# Altium project LM61495RPHR_Buck_converter_EVM.PrjPcb
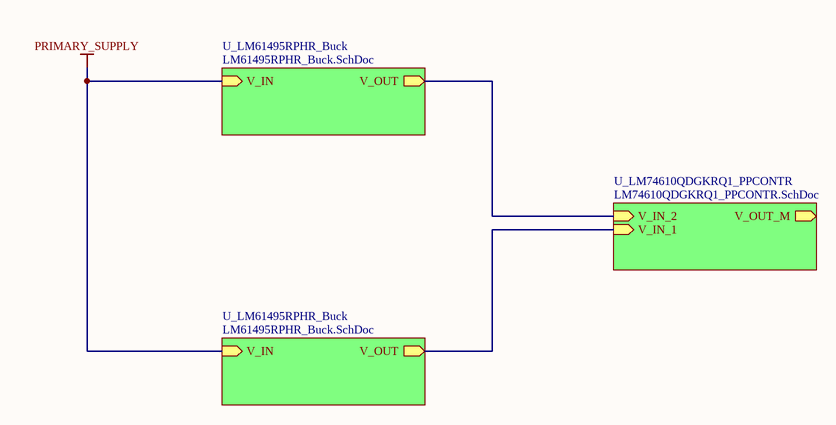
[diagram p0: DESIGN _FINAL.SchDoc]
3 sheets, 68 parts. Net scope: hierarchical (ports join the sheet entries above them; power ports are global).
Board files: LM61495RPHR_Buck.PcbDoc, LM74610QDGKRQ1_PPCONTR.PcbDoc
Sheets:
  DESIGN _FINAL.SchDoc
    U_LM61495RPHR_Buck = LM61495RPHR_Buck.SchDoc
    U_LM61495RPHR_Buck = LM61495RPHR_Buck.SchDoc
    U_LM74610QDGKRQ1_PPCONTR = LM74610QDGKRQ1_PPCONTR.SchDoc

## Sheet DESIGN _FINAL.SchDoc
size A; SheetNumber: 1; SheetTotal: 3

### Sub-sheets
U_LM61495RPHR_Buck = LM61495RPHR_Buck.SchDoc: V_IN (in), V_OUT (out)
U_LM61495RPHR_Buck = LM61495RPHR_Buck.SchDoc: V_IN (in), V_OUT (out)
U_LM74610QDGKRQ1_PPCONTR = LM74610QDGKRQ1_PPCONTR.SchDoc: V_OUT_M (out), V_IN_2 (in), V_IN_1 (in)

### Nets
PRIMARY_SUPPLY: sheet U_LM61495RPHR_Buck/V_IN, sheet U_LM61495RPHR_Buck/V_IN
Vout: sheet U_LM61495RPHR_Buck/V_OUT, sheet U_LM61495RPHR_Buck/V_OUT, sheet U_LM74610QDGKRQ1_PPCONTR/V_IN_2, sheet U_LM74610QDGKRQ1_PPCONTR/V_IN_1

## Sheet LM61495RPHR_Buck.SchDoc
size A3; SheetNumber: 2; SheetTotal: 3
Used 2 times, as channels U_LM61495RPHR_Buck, U_LM61495RPHR_Buck. Parts and nets are listed once, with the designators drawn on the sheet.
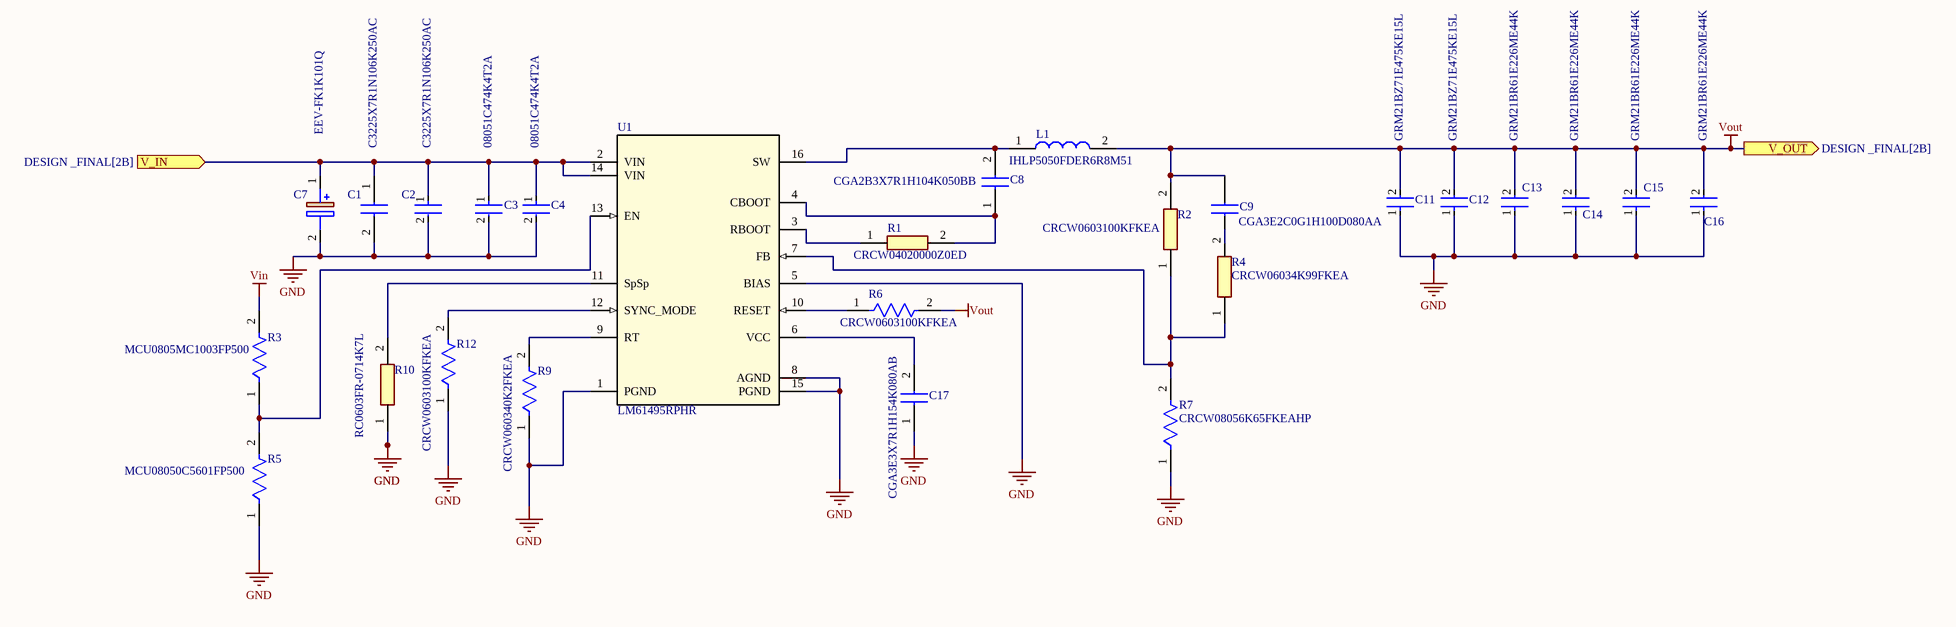
[diagram p1: LM61495RPHR_Buck.SchDoc]

### Parts
C1  C3225X7R1N106K250AC  [CAPC3225X230N]
C2  C3225X7R1N106K250AC  [FP-C3225-250-0_4-IPC_A]
C3  08051C474K4T2A  [FP-0805-L_2_01_0_2-W_1_25-MFG]
C4  08051C474K4T2A  [FP-0805-L_2_01_0_2-W_1_25-MFG]
C7  EEV-FK1K101Q  [EEEFK0J332AQ]
C8  CGA2B3X7R1H104K050BB  [CAPC1005X55N]
C9  CGA3E2C0G1H100D080AA  [CAPC1608X90N]
C11  GRM21BZ71E475KE15L  [FP-GRM21B-0_2-e0_2_0_7-MFG]
C12  GRM21BZ71E475KE15L  [FP-GRM21B-0_2-e0_2_0_7-MFG]
C13  GRM21BR61E226ME44K  [FP-GRM21B-0_2-e0_2_0_7-MFG]
C14  GRM21BR61E226ME44K  [FP-GRM21B-0_2-e0_2_0_7-MFG]
C15  GRM21BR61E226ME44K  [FP-GRM21B-0_2-e0_2_0_7-MFG]
C16  GRM21BR61E226ME44K  [FP-GRM21B-0_2-e0_2_0_7-MFG]
C17  CGA3E3X7R1H154K080AB  [GCM188]
L1  IHLP5050FDER6R8M51  [INDPM135129X640N]
R1  CRCW04020000Z0ED  [RESC1005X40N]
R2  CRCW0603100KFKEA  [RESC1608X50N]
R3  MCU0805MC1003FP500  [FP-MCU0805-IPC_B]
R4  CRCW06034K99FKEA  [RESC1608X50N]
R5  MCU08050C5601FP500  [FP-MCU0805-IPC_B]
R6  CRCW0603100KFKEA  [FP-CRCW0603C-e3-MFG]
R7  CRCW08056K65FKEAHP  [FP-CRCW0805-HPe3-IPC_C]
R9  CRCW060340K2FKEA  [FP-CRCW0603-e3-IPC_B]
R10  RC0603FR-0714K7L  [RESC1608X55N]
R12  CRCW0603100KFKEA  [FP-CRCW0603C-e3-MFG]
U1  LM61495RPHR  [RPH0016A]

### Ports
V_IN (in, see DESIGN _FINAL[2B]), V_OUT (out, see DESIGN _FINAL[2B])

### Nets
GND: C1.2 C2.2 C3.2 C4.2 C7.2(-) C11.1 C12.1 C13.1 C14.1 C15.1 C16.1 C17.1 R5.1 R7.1 R9.1 R10.1 R12.1 U1.1(PGND) U1.5(BIAS) U1.8(AGND) U1.15(PGND)
Vin: R3.2
Vout: C9.2 C11.2 C12.2 C13.2 C14.2 C15.2 C16.2 L1.2 R2.2 R6.2 ; port V_OUT
V_IN: C1.1 C2.1 C3.1 C4.1 C7.1(+) U1.2(VIN) U1.14(VIN) ; port V_IN
NetC8_1: C8.1 R1.2 U1.4(CBOOT)
NetC8_2: C8.2 L1.1 U1.16(SW)
NetC9_1: C9.1 R4.2
NetC17_2: C17.2 U1.6(VCC)
NetR1_1: R1.1 U1.3(RBOOT)
NetR2_1: R2.1 R4.1 R7.2 U1.7(FB)
NetR3_1: R3.1 R5.2 U1.13(EN)
NetR6_1: R6.1 U1.10(RESET)
NetR9_2: R9.2 U1.9(RT)
NetR10_2: R10.2 U1.11(SpSp)
NetR12_2: R12.2 U1.12(SYNC_MODE)

### Channels
U_LM61495RPHR_Buck: designators end in _U_LM61495RPHR_Buck#1; ports V_IN=PRIMARY_SUPPLY V_OUT=Vout
U_LM61495RPHR_Buck: designators end in _U_LM61495RPHR_Buck#2; ports V_IN=PRIMARY_SUPPLY V_OUT=Vout

### Library data of the parts
C1 = C3225X7R1N106K250AC: Capacitor; Manufacturer_Name: TDK; Datasheet Link: https://product.tdk.com/info/en/catalog/datasheets/mlcc_commercial_midvoltage_en.pdf; Height: 2.3mm; Manufacturer_Part_Number: C3225X7R1N106K250AC; Mouser Part Number: 810-C3225X7R1N106K25; Mouser Price/Stock: https://www.mouser.co.uk/ProductDetail/TDK/C3225X7R1N106K250AC?qs=P1JMDcb91o5%2Fi%252BA2Vs0UoQ%3D%3D; Arrow Part Number: C3225X7R1N106K250AC; Arrow Price/Stock: https://www.arrow.com/en/products/c3225x7r1n106k250ac/tdk?region=nac
C2 = CMP-08246-003742-1: Multilayer Ceramic Capacitors 10uF ±10% 75V X7R SMD 1210; RoHS Compliant: Yes
C3 C4 = CMP-2007-04773-2: Automotive Ceramic Capacitor, 0805, 470nF, 10%, X7R, 15%, 100V; Packaging: Tape and Reel; Depth: 1.25mm; Voltage Rating (DC): 100V; Length: 2.01mm; Tolerance: 10%; Construction: Flat; Lead Free: Lead Free; Case Code (Metric): 2012; Capacitance: 470nF; Case Code (Imperial): 0805; Max Operating Temperature: 125°C; Dielectric: X7R; Mount: Surface Mount; Min Operating Temperature: -55°C; Voltage Rating: 100V; Radiation Hardening: No; Termination: SMD/SMT; Case/Package: 0805
C7 = EEV-FK1K101Q: Capacitor Polarised; Manufacturer_Name: Panasonic; Datasheet Link: http://industrial.panasonic.com/cdbs/www-data/pdf/RDE0000/ABA0000C1181.pdf; Height: 15mm; Manufacturer_Part_Number: EEV-FK1K101Q; Mouser Part Number: 667-EEV-FK1K101Q; Mouser Price/Stock: https://www.mouser.co.uk/ProductDetail/Panasonic/EEV-FK1K101Q?qs=E4hy2mN5dtmkz2M2wNGN2w%3D%3D; Arrow Part Number: EEV-FK1K101Q; Arrow Price/Stock: https://www.arrow.com/en/products/eev-fk1k101q/panasonic?utm_currency=USD&region=nac
C8 = CGA2B3X7R1H104K050BB: Capacitor; Manufacturer_Name: TDK; Datasheet Link: http://docs-europe.electrocomponents.com/webdocs/14e9/0900766b814e9125.pdf; Height: 0.55mm; Manufacturer_Part_Number: CGA2B3X7R1H104K050BB; Mouser Part Number: 810-CGA2B3X7R1H104K; Mouser Price/Stock: https://www.mouser.co.uk/ProductDetail/TDK/CGA2B3X7R1H104K050BB?qs=NRhsANhppD%252ByZlMHlsweIw%3D%3D; Arrow Part Number: CGA2B3X7R1H104K050BB; Arrow Price/Stock: https://www.arrow.com/en/products/cga2b3x7r1h104k050bb/tdk?region=nac
C9 = CGA3E2C0G1H100D080AA_1: TDK 0603 CGA 10pF Ceramic Multilayer Capacitor, 50 V dc, +125C, C0G Dielectric, +/-0.5pF; Geometry.Height: 0.9mm; Manufacturer_Name: TDK; Manufacturer_Part_Number: CGA3E2C0G1H100D080AA; Mouser Part Number: 810-CGA3E2C0G1H100D; Mouser Price/Stock: https://www.mouser.co.uk/ProductDetail/TDK/CGA3E2C0G1H100D080AA?qs=FxQuwy19cyAWoBWxXEx%2FUg%3D%3D; Arrow Part Number: *; Arrow Price/Stock: *; Datasheet Link: http://docs-europe.electrocomponents.com/webdocs/14e9/0900766b814e9125.pdf
C11 C12 = CMP-06035-039079-1: Chip Multilayer Ceramic Capacitors for General Purpose, 0805, 4.7uF, X7R, 15%, 10%, 25V
C13-C16 = CMP-06035-036790-1: Chip Multilayer Ceramic Capacitors for General Purpose, 0805, 22uF, X5R, 15%, 20%, 25V; Mount: Surface Mount; Voltage Rating: 25V; Capacitance: 22uF; Weight: 0.000335oz; Max Operating Temperature: 85°C; Dielectric: X5R; Length: 0.079inch; Voltage Rating (DC): 25V; Resistor Type: Ceramic; Package Quantity: 10000; Case Code (Imperial): 0805; Tolerance: 20%; Height: 1.25mm; Case/Package: 0805; Case Code (Metric): 2012; Min Operating Temperature: -55°C; Packaging: Tape and Reel; Thickness: 0.057inch; Width: 1.25mm; Termination: SMD/SMT
C17 = GCM188R71C105MA64D: CAP CER 0.15UF 50V X7R 0603; Manufacturer_Name: Murata Electronics; Datasheet Link: https://search.murata.co.jp/Ceramy/image/img/A01X/G101/ENG/GCM188R71C105MA64-04A.pdf; Height: 0.9mm; Manufacturer_Part_Number: GCM188R71C105MA64D; Mouser Part Number: 81-GCM188R71C105MA4D; Mouser Price/Stock: https://www.mouser.com/Search/Refine.aspx?Keyword=81-GCM188R71C105MA4D; Arrow Part Number: GCM188R71C105MA64D; Arrow Price/Stock: https://www.arrow.com/en/products/gcm188r71c105ma64d/murata-manufacturing
L1 = IHLP5050FDER6R8M51: Inductor; Manufacturer_Name: Vishay; Datasheet Link: https://www.mouser.com/datasheet/2/427/ihlp5050fd51-1763968.pdf; Height: 6.4mm; Manufacturer_Part_Number: IHLP5050FDER6R8M51; Mouser Part Number: 70-IHLP5050FDR6R8M51; Mouser Price/Stock: https://www.mouser.co.uk/ProductDetail/Vishay-Dale/IHLP5050FDER6R8M51?qs=tDDpbAIEejpo82ME3ZJqPQ%3D%3D
R1 = CRCW04020000Z0EDHP: Resistor; Manufacturer_Name: Vishay; Datasheet Link: http://www.vishay.com/docs/20035/dcrcwe3.pdf; Height: 0.4mm; Manufacturer_Part_Number: CRCW04020000Z0EDHP; Mouser Part Number: 71-CRCW04020000Z0EDH; Mouser Price/Stock: https://www.mouser.co.uk/ProductDetail/Vishay-Dale/CRCW04020000Z0EDHP?qs=pTGEtN%252BMLlAWtXUIKBil9w%3D%3D; Arrow Part Number: CRCW04020000Z0EDHP; Arrow Price/Stock: https://www.arrow.com/en/products/crcw04020000z0edhp/vishay?utm_currency=USD&region=nac
R2 = CRCW0603100KFKEA: Resistor; Manufacturer_Name: Vishay; Datasheet Link: http://www.vishay.com/docs/20035/dcrcwe3.pdf; Height: 0.5mm; Manufacturer_Part_Number: CRCW0603100KFKEA; Mouser Part Number: 71-CRCW0603-100K-E3; Mouser Price/Stock: https://www.mouser.co.uk/ProductDetail/Vishay-Dale/CRCW0603100KFKEA?qs=6dqgS%252BKntICWHMMdIzt5%2FQ%3D%3D; Arrow Part Number: CRCW0603100KFKEA; Arrow Price/Stock: https://www.arrow.com/en/products/crcw0603100kfkea/vishay?utm_currency=USD&region=nac
R3 = CMP-02407-000323-1: RES 1.05K OHM 0.5% 1/5W 0805; Tolerance: 1%; Resistance: 100kR; Max Operating Temperature: 125°C; Packaging: Tape and Reel; Min Operating Temperature: -55°C; Depth: 1.25mm; Case/Package: 0805; Military Standard: Not; Composition: Thin Film; Length: 2mm
R4 = CRCW06034K99FKEA: Resistor; Manufacturer_Name: Vishay; Datasheet Link: http://www.vishay.com/docs/20035/dcrcwe3.pdf; Height: 0.5mm; Manufacturer_Part_Number: CRCW06034K99FKEA; Mouser Part Number: 71-CRCW0603-4.99K-E3; Mouser Price/Stock: https://www.mouser.co.uk/ProductDetail/Vishay-Dale/CRCW06034K99FKEA?qs=hsLMhf4r0Mayldu5NgAo%2Fg%3D%3D; Arrow Part Number: CRCW06034K99FKEA; Arrow Price/Stock: https://www.arrow.com/en/products/crcw06034k99fkea/vishay?region=nac
R5 = CMP-02407-001419-1: RES 1.05K OHM 0.5% 1/5W 0805; Resistance: 5.6kR; Tolerance: 1%; Temperature Coefficient: 50ppm/°C; Case/Package: 0805; Depth: 1.25mm; Radiation Hardening: No; Military Standard: Not; Packaging: Tape and Reel; Max Operating Temperature: 125°C; Composition: Thin Film; Lead Free: Lead Free; Contact Plating: Tin; Length: 2mm; Min Operating Temperature: -55°C; Width: 1.25mm
R6 R12 = CMP-02407-011574-1: RES SMD 100K OHM 1% 1/10W 0603; Temperature Coefficient: 100ppm/°C; Resistance: 100kR; Power Rating: 100mW; Value: 100kR; Contact Plating: Tin; Length: 1.55mm; Mount: Surface Mount; Min Operating Temperature: -55°C; RoHS Compliant: Yes; Max Operating Temperature: 155°C; Tolerance: 1%; Resistor Type: Thick Film; Termination: Wraparound; Case/Package: Molded; Lead Free: Lead Free
R7 = CMP-02407-011694-1: RES Thick Film, 6.65kΩ, 1%, 0.5W, 100ppm/°C, 0805; Max Power Dissipation: 333mW; Resistance: 6.65kR; Temperature Coefficient: 100ppm/°C; Tolerance: 1%; Package Quantity: 5000; Lead Free: Lead Free; Case/Package: 0805; Length: 0.079inch; Series: CRCW-HP; Number of Terminations: 2; Features: Automotive AEC-Q200; Width: 0.049inch; Resistor Type: Thick Film; RoHS Compliant: Yes; Height: 0.024inch; Packaging: Tape and Reel
R9 = CMP-2000-03336-2: RES Thick Film, 40.2kΩ, 1%, 0.1W, 100ppm/°C, 0603; Voltage Rating (DC): 75V; Power Rating: 100mW; Resistance: 40.2kR; Value: 40.2kR; Packaging: Tape and Reel; Radiation Hardening: No; Lead Free: Lead Free; Contact Plating: Tin; Weight: 7.1E-05oz; Voltage Rating: 75V; Temperature Coefficient: 100ppm/°C; Case Code (Imperial): 0603; Max Operating Temperature: 155°C; Width: 0.85mm; Package Quantity: 5000; Termination: SMD/SMT; Case/Package: 0603; Case Code (Metric): 1608; Depth: 0.85mm; Tolerance: 1%; Composition: Thick Film; Length: 1.55mm; Military Standard: Not; Height: 0.45mm; Min Operating Temperature: -55°C
R10 = RC0603FR-0714K7L: Resistor; Manufacturer_Name: KEMET; Datasheet Link: http://www.yageo.com/documents/recent/PYu-RC0603_51_RoHS_L_v5.pdf; Height: 0.55mm; Manufacturer_Part_Number: RC0603FR-0714K7L; Mouser Part Number: 603-RC0603FR-0714K7L; Mouser Price/Stock: https://www.mouser.co.uk/ProductDetail/YAGEO/RC0603FR-0714K7L?qs=VU8sRB4EgwDFr61Mr4NajA%3D%3D
U1 = LM61495RPHR: 10-A buck converter optimized for power density and low EMI 16-VQFN-HR -40 to 150; Manufacturer_Name: Texas Instruments; TYPE: TYPE; RefDes: RefDes; Copyright: Copyright (C) 2025 Ultra Librarian. All rights reserved.; Manufacturer_Part_Number: LM61495RPHR; Datasheet: https://www.ti.com/lit/gpn/lm61495

## Sheet LM74610QDGKRQ1_PPCONTR.SchDoc
size A3; SheetNumber: 3; SheetTotal: 3
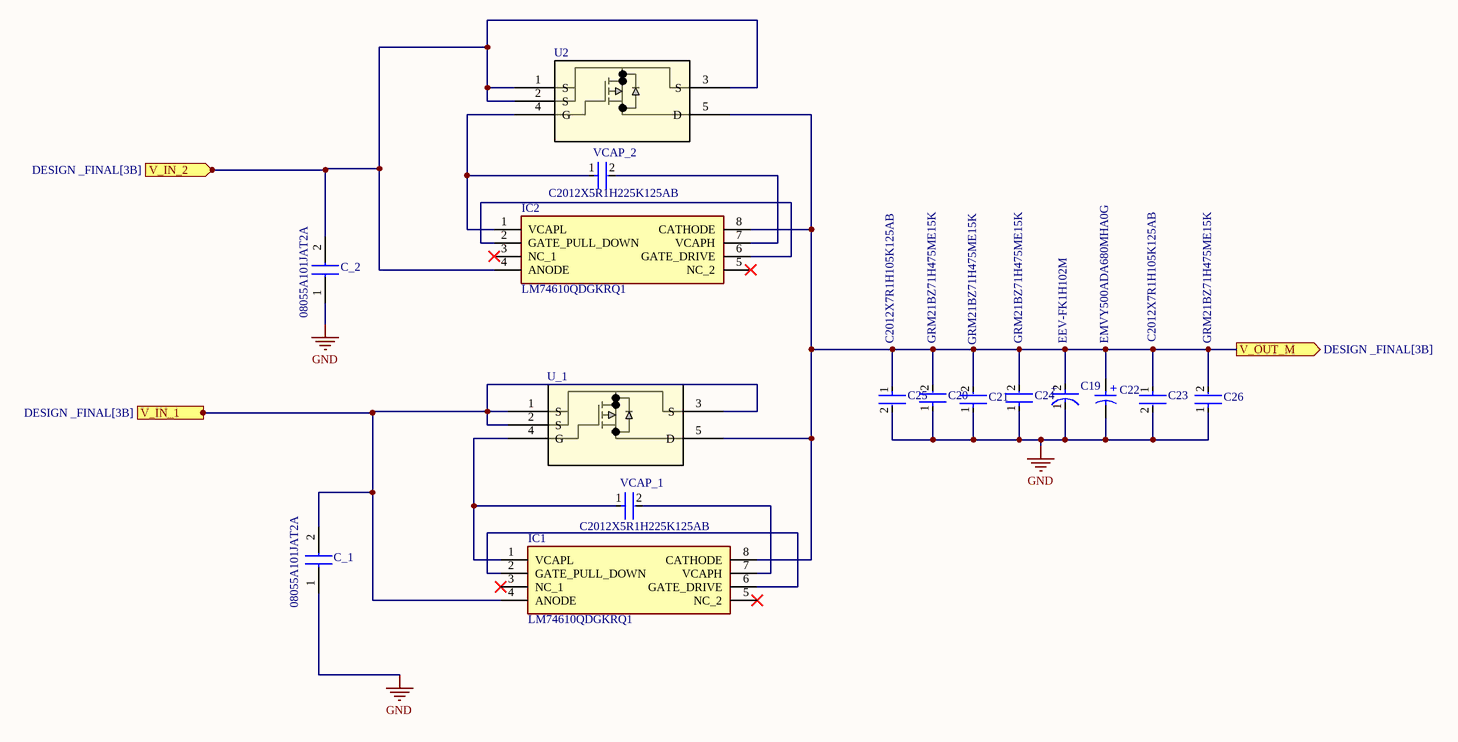
[diagram p2: LM74610QDGKRQ1_PPCONTR.SchDoc]

### Parts
C19  EEV-FK1H102M  [FP-FK-J16-MFG]
C20  GRM21BZ71H475ME15K  [FP-GRM21B-0_2-e0_2_0_7-MFG]
C21  GRM21BZ71H475ME15K  [FP-GRM21B-0_2-e0_2_0_7-MFG]
C22  EMVY500ADA680MHA0G  [WCAP-ASLI_D8H10.5]
C23  C2012X7R1H105K125AB  [FP-C2012-125-0_2-MFG]
C24  GRM21BZ71H475ME15K  [FP-GRM21B-0_2-e0_2_0_7-MFG]
C25  C2012X7R1H105K125AB  [FP-C2012-125-0_2-MFG]
C26  GRM21BZ71H475ME15K  [FP-GRM21B-0_2-e0_2_0_7-MFG]
C_1  08055A101JAT2A  [GRM21BR60J226ME39L]
C_2  08055A101JAT2A  [GRM21BR60J226ME39L]
IC1  LM74610QDGKRQ1  [SOP65P490X110-8N]
IC2  LM74610QDGKRQ1  [SOP65P490X110-8N]
U2  SQJ422EP-T1_GE3  [SO-8L_VIS]  (value not drawn)
U_1  SQJ422EP-T1_GE3  [SO-8L_VIS]  (value not drawn)
VCAP_1  C2012X5R1H225K125AB  [FP-C2012-125-0_2-IPC_C]
VCAP_2  C2012X5R1H225K125AB  [FP-C2012-125-0_2-IPC_C]

### Ports
V_IN_1 (in, see DESIGN _FINAL[3B]), V_IN_2 (in, see DESIGN _FINAL[3B]), V_OUT_M (out, see DESIGN _FINAL[3B])

### Nets
GND: C19.1(C) C20.1 C21.1 C22.2(N) C23.2 C24.1 C25.2 C26.1 C_1.1 C_2.1
Vout: C_1.2 C_2.2 IC1.4(ANODE) IC2.4(ANODE) U2.1(S) U2.2(S) U2.3(S) U_1.1(S) U_1.2(S) U_1.3(S) ; port V_IN_2, port V_IN_1
NetC19_2: C19.2(A) C20.2 C21.2 C22.1(P) C23.1 C24.2 C25.1 C26.2 IC1.8(CATHODE) IC2.8(CATHODE) U2.5(D) U_1.5(D) ; port V_OUT_M
NetIC1_1: IC1.1(VCAPL) U_1.4(G) VCAP_1.1
NetIC1_2: IC1.2(GATE_PULL_DOWN) IC1.6(GATE_DRIVE)
NetIC1_7: IC1.7(VCAPH) VCAP_1.2
NetIC2_1: IC2.1(VCAPL) U2.4(G) VCAP_2.1
NetIC2_2: IC2.2(GATE_PULL_DOWN) IC2.6(GATE_DRIVE)
NetIC2_7: IC2.7(VCAPH) VCAP_2.2

Not connected (* = marked no-connect by the designer): IC1 3(NC_1)* 5(NC_2)*; IC2 3(NC_1)* 5(NC_2)*

### Notes on the sheet
- (in symbol CMP-03913-53914624-1) +
- (in symbol CMP-05427-000011-1) +

### Library data of the parts
C19 = CMP-05427-000011-1: CAP ALUM 1000UF 20% 50V SMD; Manufacturer: Panasonic Electronic Components; Esr: 0.073Ω; Life: 2000Hours; Leakage Current: 500uA; Ripple Current: 1610mA; Dissipation Factor: 10%; Automotive Grade: Grade 2; Material: Aluminum; Capacitance: 1000uF; Tolerance: 20%; Device Class L1: Passive Components; Temperature: -55°C to +105°C; Device Class L2: Capacitors; Mouser Description: Cap Aluminum Lytic 1000uF 50V 20% (16 X 16.5mm) SMD 0.073 Ohm 1610mA 2000h 105C Automotive T/R; Category: Cap; Digikey Description: CAP ALUM 1000UF 20% 50V SMD; Value: 1000uF; Manufacturer Part Number: EEV-FK1H102M; Lead Free: Yes; Octopart: https://octopart.com/eev-fk1h102m-panasonic-39480688; Temperature Range High: +105°C; Package: FK-J16; Device Class L3: Aluminum Electrolytic Capacitors; ComponentLink2Description: Datasheet; RoHS: TRUE; Height: 17mm; ComponentLink2URL: https://b2b-api.panasonic.eu/file_stream/pids/fileversion/3127; Voltage Rating: 50V; Temperature Range Low: -55°C; Automotive: Yes
C20 C21 C24 C26 = CMP-06035-012295-1: Chip Multilayer Ceramic Capacitors for General Purpose, 0805, 4.7uF, X7R, 15%, 20%, 50V
C22 = CMP-03913-53914624-1: 865080653015 WCAP-ASLI Aluminum Electrolytic Capacitors; ESR (Equivalent Series Resistance): 276.092mΩ; Voltage Rating: 50V; Tolerance: 20%; Leakage Current: 34µA; Polarity: Polar; Life (Hours): 2000hours; Ripple Current: 320mA; Capacitance: 68µF; Insulation Resistance: 1.47059MΩ; Impedance: 500mΩ; Value: 68µF; Packaging: Tape & Reel (TR); Min Operating Temperature: -55°C; Max Operating Temperature: 105°C; Height - Seated (Max): 10.4902mm; Mount: Surface Mount; Width: 8.3mm; Height: 10.5mm; Diameter: 8mm; Ripple Current (AC): 320mA; RoHS: Compliant; Case/Package: Radial; REACH SVHC: Unknown; NexarPartId: 53914624; Voltage Rating (DC): 50V; Length: 10.5mm
C23 C25 = CMP-08246-006515-1: Multilayer Ceramic Capacitors 1μF ±10% 50V X7R SMD 0805; Capacitance: 1uF; Value: 1uF; Thickness: 0.057inch; REACH SVHC: No SVHC; Dielectric: X7R; Termination: SMD/SMT; Length: 2mm; Package Quantity: 1; Min Operating Temperature: -55°C; Number of Pins: 2; Series: C; Lead Free: Lead Free; Case/Package: 0805; Packaging: Tape and Reel; Voltage Rating (DC): 50V; Voltage Rating: 50V; Case Code (Imperial): 0805; Case Code (Metric): 2012; RoHS Compliant: Yes; Construction: Flat; Radiation Hardening: No; Weight: 0.000194oz; Resistor Type: Ceramic; Width: 0.049inch; Mount: Surface Mount; Max Operating Temperature: 125°C; Dielectric Material: Ceramic; Height: 1.25mm; Depth: 1.25mm; Tolerance: 10%
C_1 C_2 = GRM21BR61H106KE43L: Capacitor; Manufacturer_Name: Murata Electronics; Datasheet Link: https://search.murata.co.jp/Ceramy/image/img/A01X/G101/ENG/GRM21BR61H106KE43-01A.pdf; Height: 1.45mm; Manufacturer_Part_Number: GRM21BR61H106KE43L; Mouser Part Number: 81-GRM21BR61H106KE3L; Mouser Price/Stock: https://www.mouser.co.uk/ProductDetail/Murata-Electronics/GRM21BR61H106KE43L?qs=lYGu3FyN48cBZlIduWKclg%3D%3D; Arrow Part Number: GRM21BR61H106KE43L; Arrow Price/Stock: https://www.arrow.com/en/products/grm21br61h106ke43l/murata-manufacturing?utm_currency=USD&region=europe
IC1 IC2 = LM74610QDGKRQ1: Integrated Circuit; Manufacturer_Name: Texas Instruments; Datasheet Link: http://www.ti.com/lit/gpn/lm74610-q1; Height: 1.1mm; Manufacturer_Part_Number: LM74610QDGKRQ1; Mouser Part Number: 595-LM74610QDGKRQ1; Mouser Price/Stock: https://www.mouser.co.uk/ProductDetail/Texas-Instruments/LM74610QDGKRQ1?qs=3jdCaFhktOQTVpuuubgDqg%3D%3D; Arrow Part Number: LM74610QDGKRQ1; Arrow Price/Stock: https://www.arrow.com/en/products/lm74610qdgkrq1/texas-instruments?region=nac
U2 U_1 = SQJ422EP-T1_GE3: N-CHANNEL 40-V (D-S) 175C MOSFET; Manufacturer_Name: Vishay; Copyright: Copyright (C) 2025 Ultra Librarian. All rights reserved.; Manufacturer_Part_Number: SQJ422EP-T1_GE3; Datasheet: https://www.vishay.com/doc?63989; RefDes: RefDes; Type: Type
VCAP_1 VCAP_2 = CMP-08246-005698-1: Multilayer Ceramic Capacitors 2.2μF ±10% 50V X5R SMD 0805; Insulation Resistance: 10GR; Dissipation Factor: 5%; Capacitance: 2.2uF; Width: 1.2mm; Packaging: Tape and Reel; REACH SVHC: No SVHC; Dielectric: X5R; Dielectric Material: Ceramic; Voltage Rating: 50V; Radiation Hardening: No; Height: 1.25mm; Termination: SMD/SMT; Max Operating Temperature: 85°C; Resistor Type: Ceramic; Package Quantity: 1; Min Operating Temperature: -55°C; Weight: 0.000194oz; Thickness: 0.057inch; Lead Free: Lead Free; Tolerance: 10%; Voltage Rating (DC): 50V; RoHS Compliant: Yes; Construction: Flat; Mount: Surface Mount; Depth: 1.25mm; Length: 2mm; Case Code (Imperial): 0805; Case/Package: 0805; Series: C; Case Code (Metric): 2012

## Nets that join several sheets
GND: U_LM61495RPHR_Buck (21 pins), U_LM61495RPHR_Buck (21 pins), LM74610QDGKRQ1_PPCONTR (10 pins)
PRIMARY_SUPPLY: U_LM61495RPHR_Buck (7 pins), U_LM61495RPHR_Buck (7 pins)
Vin: U_LM61495RPHR_Buck (R3_U_LM61495RPHR_Buck#1.2), U_LM61495RPHR_Buck (R3_U_LM61495RPHR_Buck#2.2)
Vout: U_LM61495RPHR_Buck (10 pins), U_LM61495RPHR_Buck (10 pins), LM74610QDGKRQ1_PPCONTR (10 pins)